# Altium project PCB C3I.PrjPcb
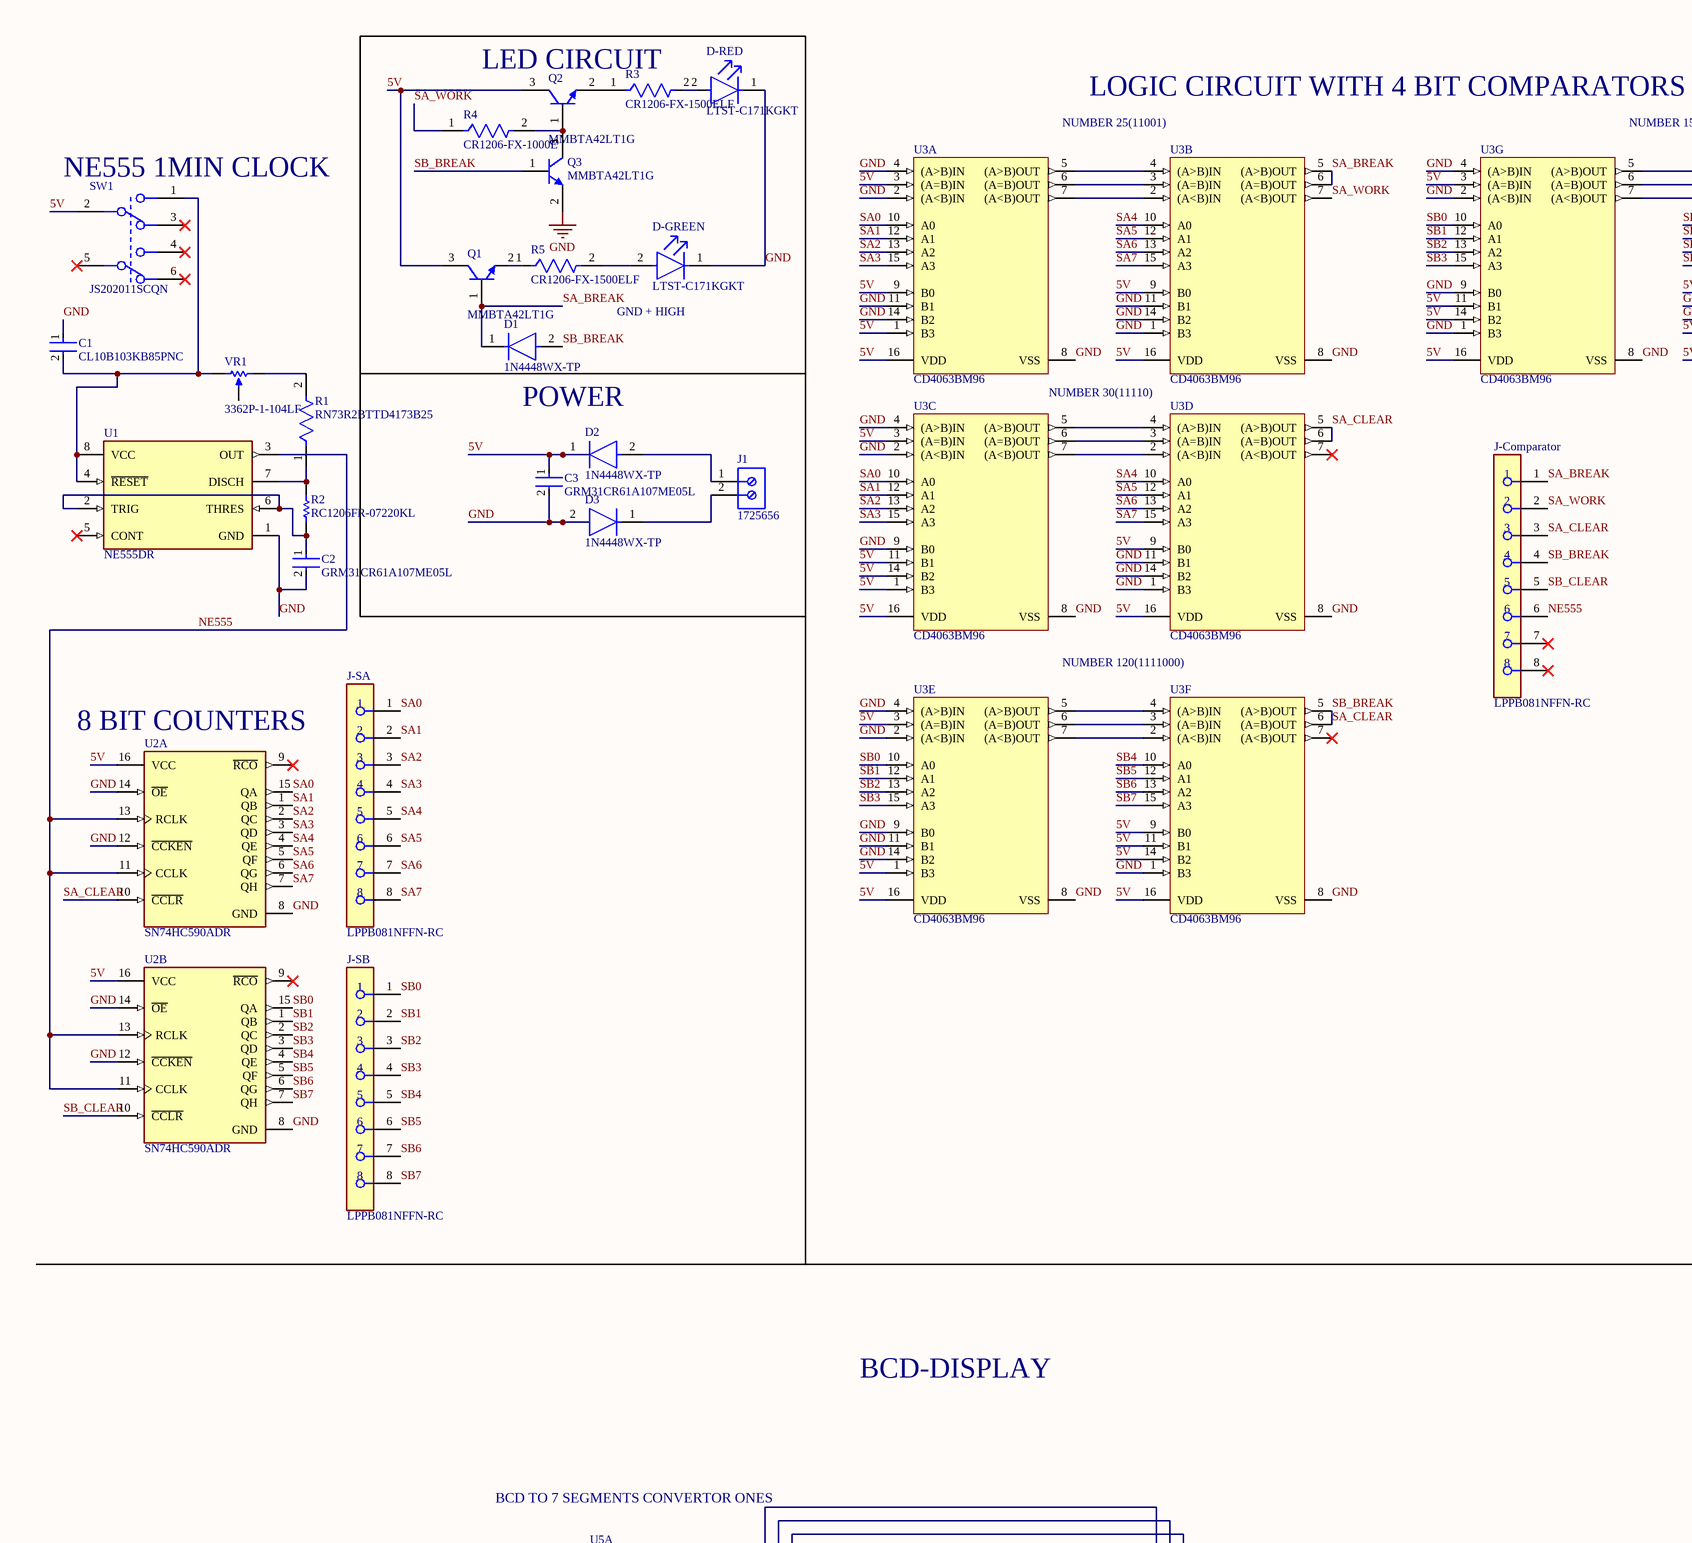
[diagram p0: C3I.SchDoc, top left]
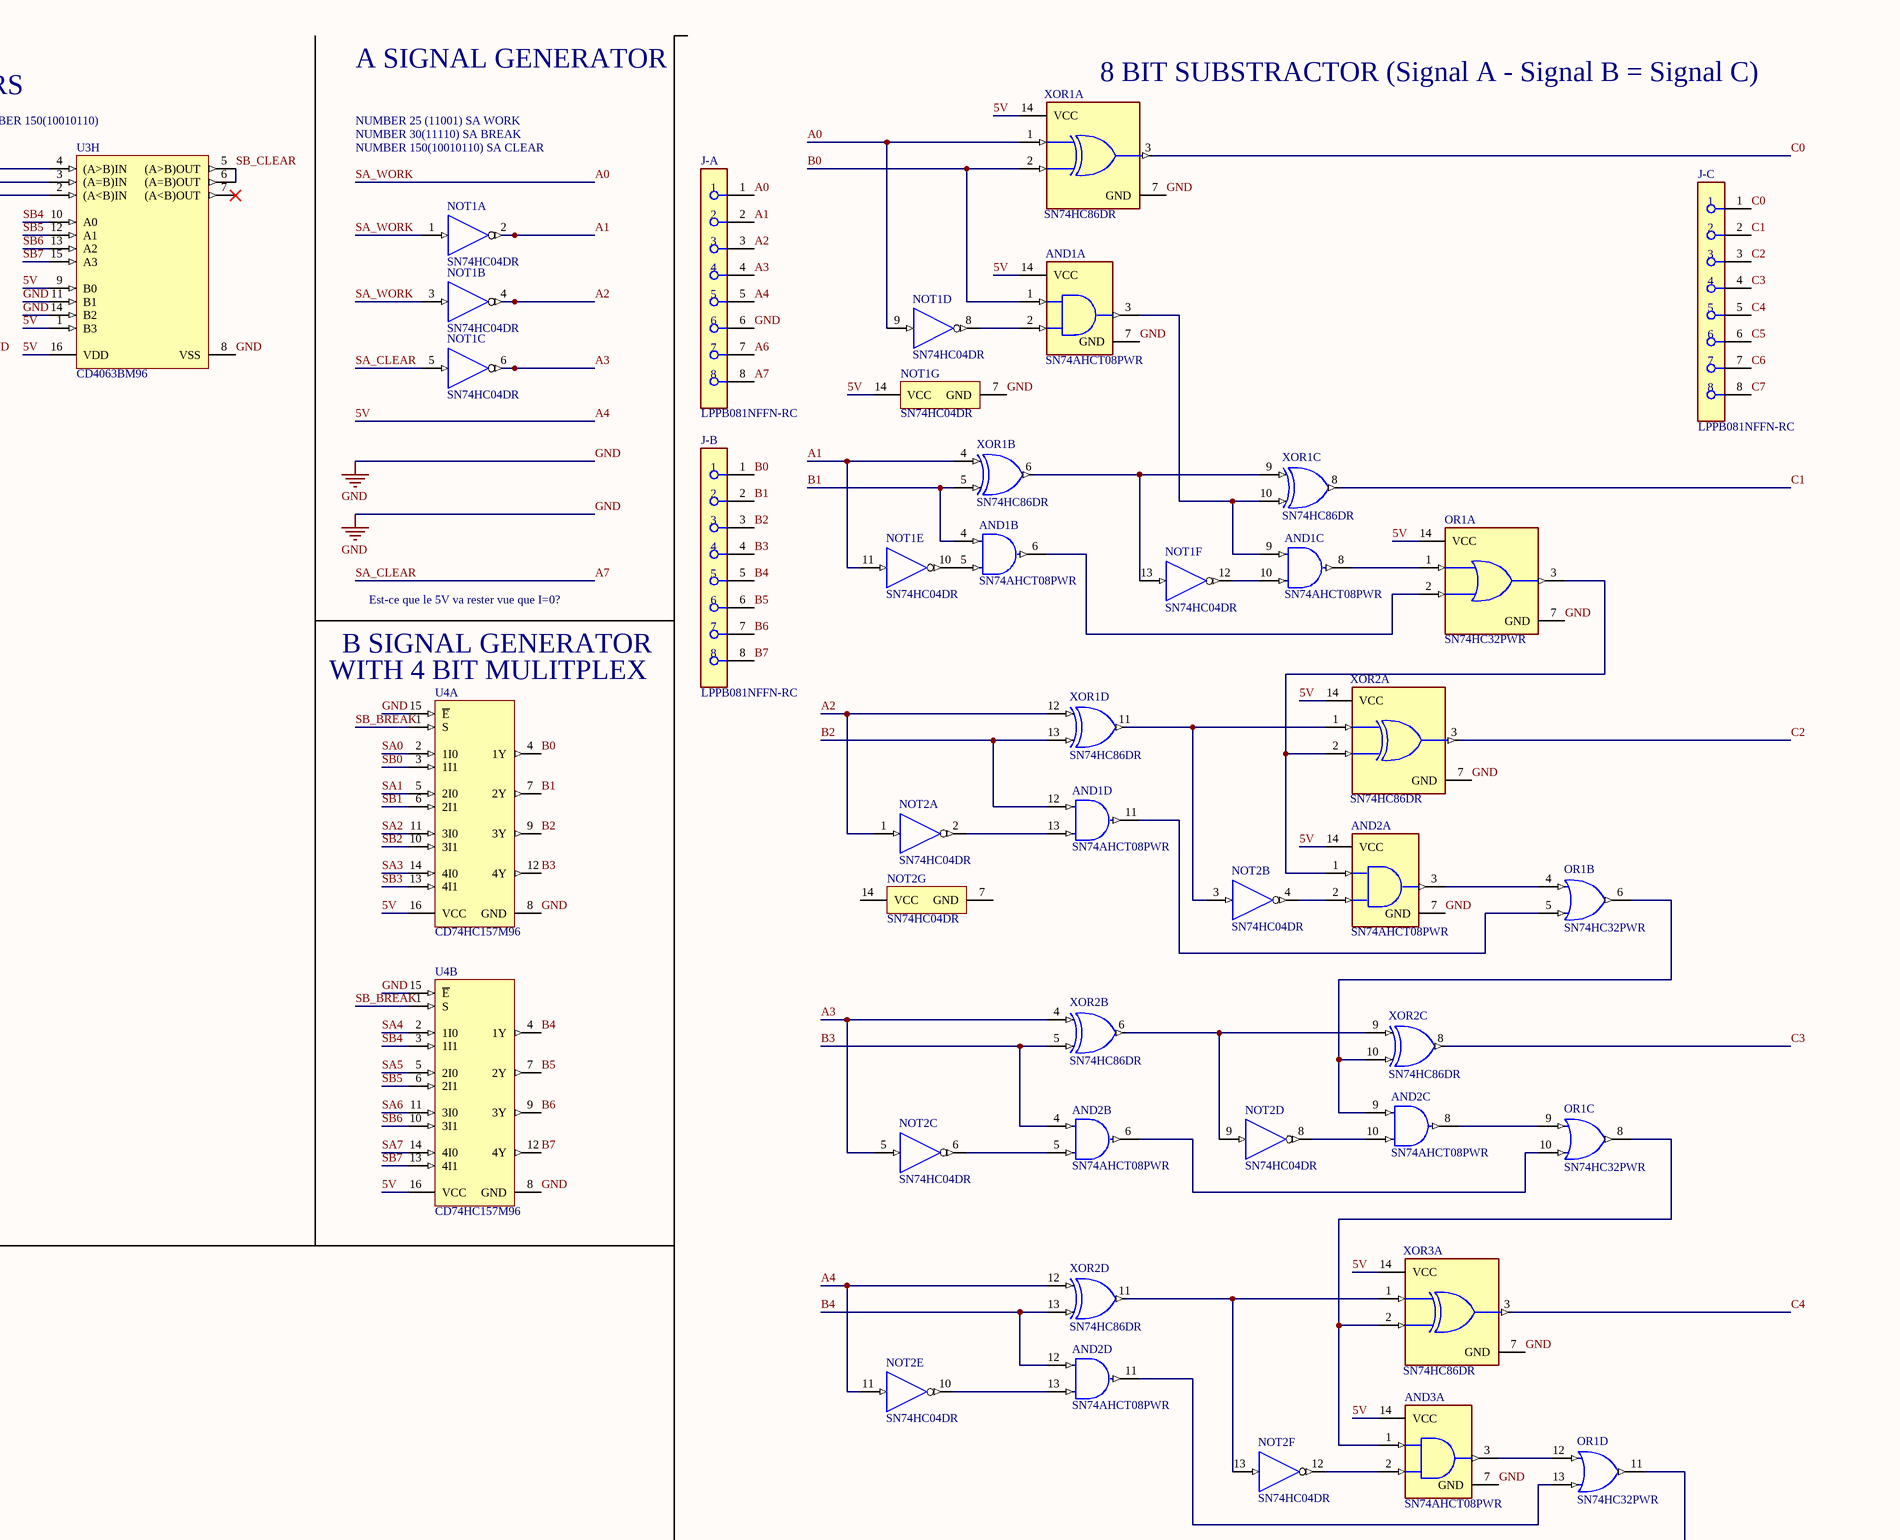
[diagram p1: C3I.SchDoc, top middle]
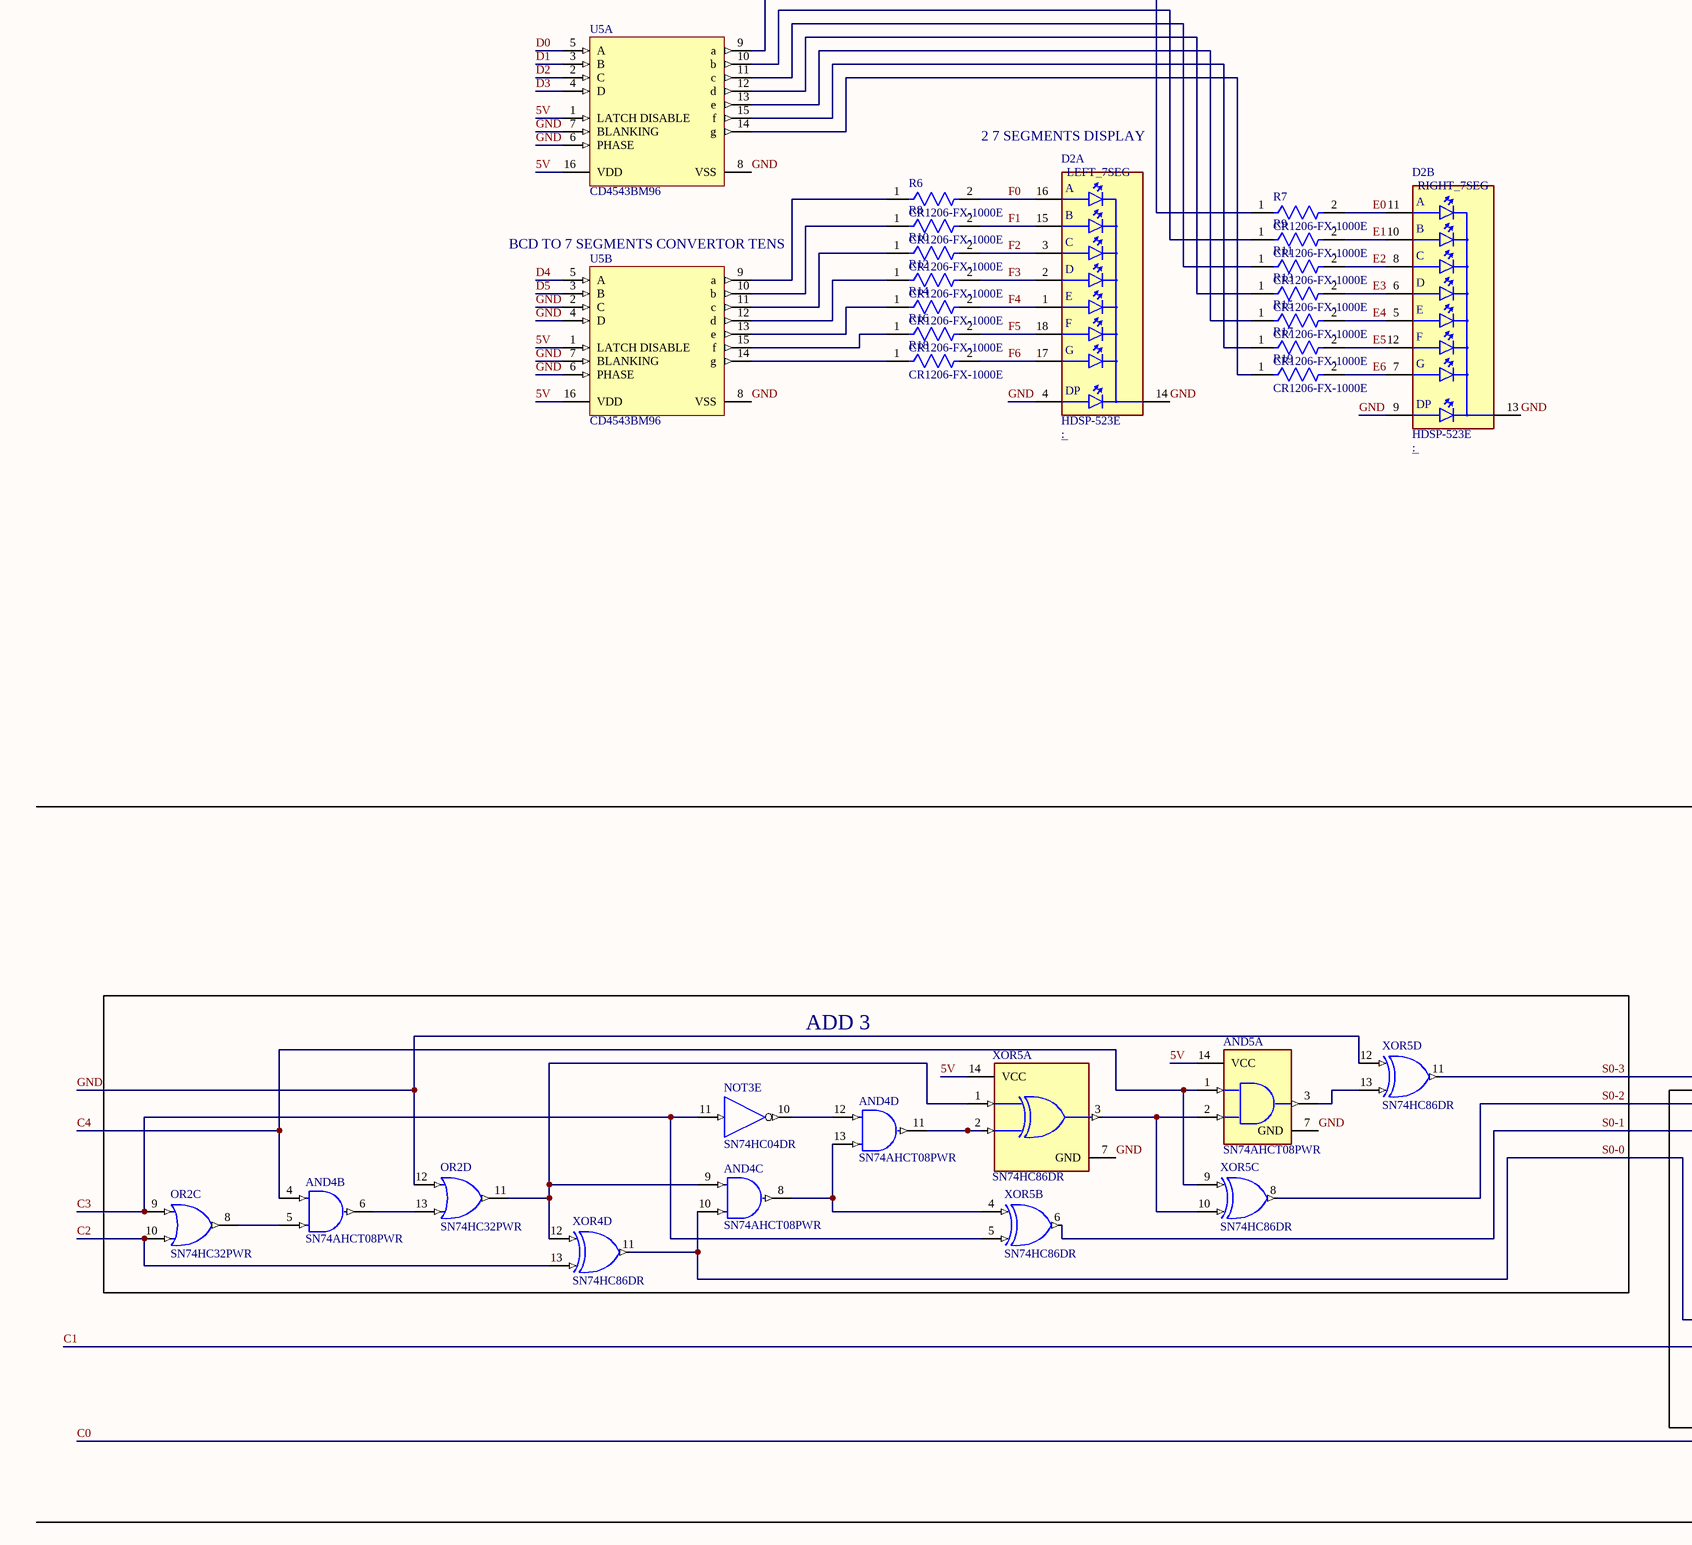
[diagram p2: C3I.SchDoc, bottom left]
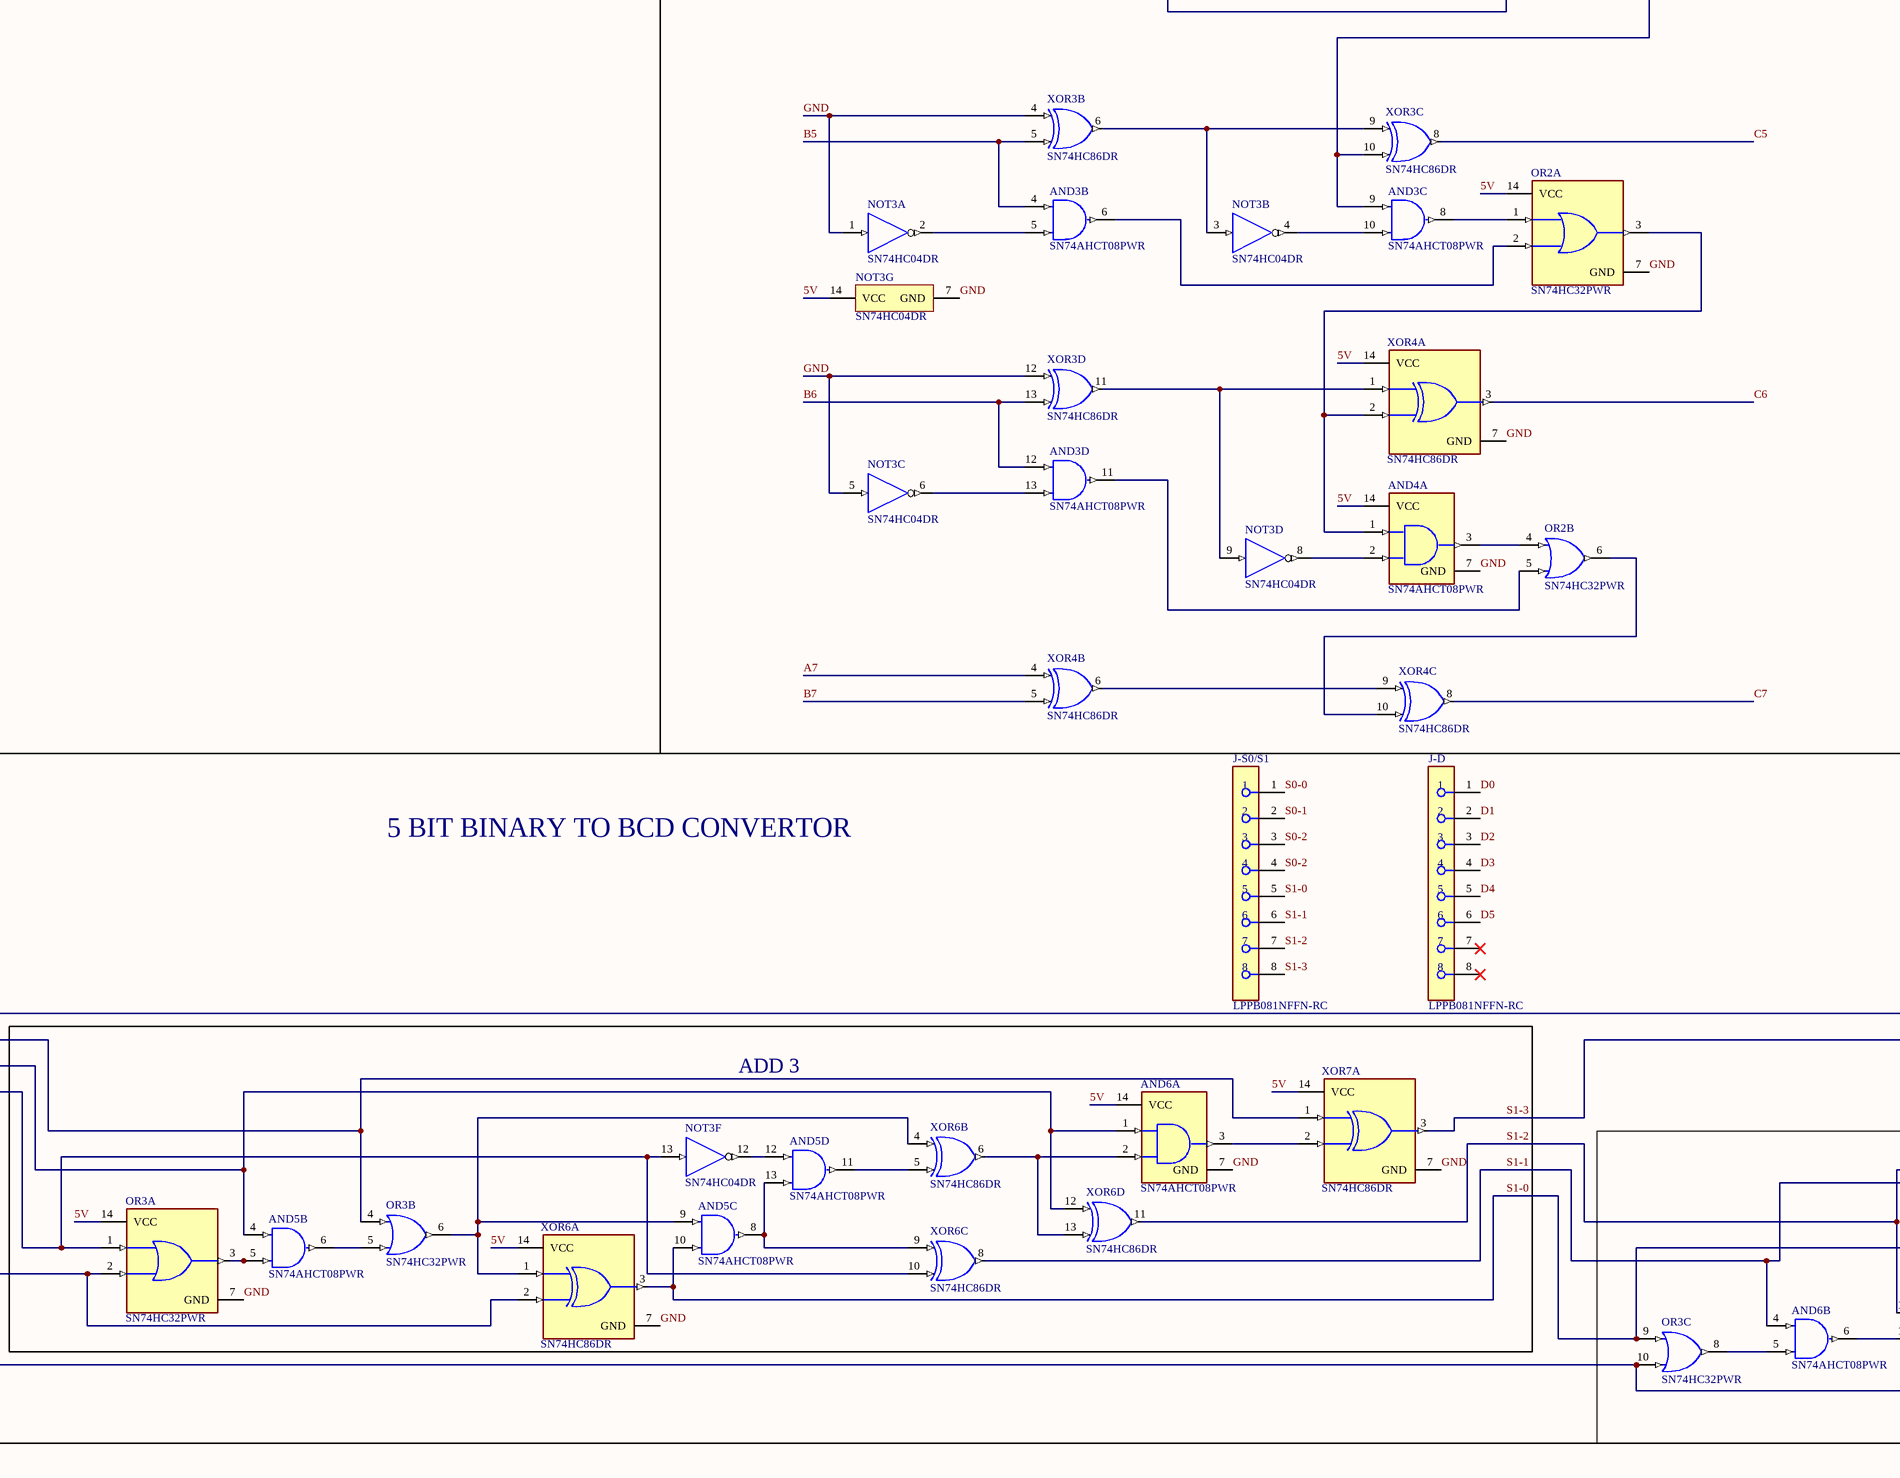
[diagram p3: C3I.SchDoc, bottom middle]
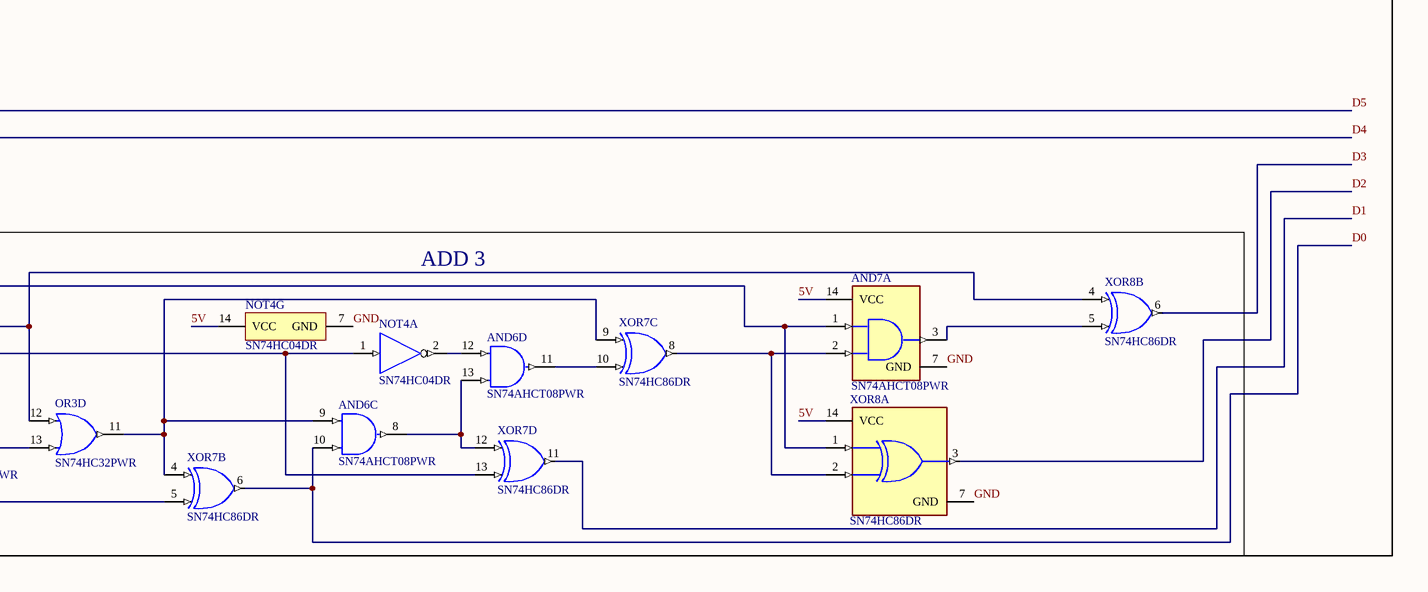
[diagram p4: C3I.SchDoc, bottom right]
1 sheet, 79 parts. Net scope: global (net labels, ports and power ports of the same name join across sheets).
Board file: C3I.PcbDoc

## Sheet C3I.SchDoc
size E; SheetNumber: 1; SheetTotal: 1

### Parts
(Parts that share a designator on the sheet are numbered #1, #2 ... from top to bottom, then left to right.)
AND1  SN74AHCT08PWR  [FP-PW0014A-IPC_C]  (parts A,B,C,D of 4)
AND2  SN74AHCT08PWR  [FP-PW0014A-IPC_C]  (parts A,B,C,D of 4)
AND3  SN74AHCT08PWR  [FP-PW0014A-IPC_C]  (parts A,B,C,D of 4)
AND4  SN74AHCT08PWR  [FP-PW0014A-IPC_C]  (parts A,B,C,D of 4)
AND5  SN74AHCT08PWR  [FP-PW0014A-IPC_C]  (parts A,B,C,D of 4)
AND6  SN74AHCT08PWR  [FP-PW0014A-IPC_C]  (parts A,B,C,D of 4)
AND7  SN74AHCT08PWR  [FP-PW0014A-IPC_C]  (part A of 4)
C1  CL10B103KB85PNC  [FP-CL10-IPC_B]
C2  GRM31CR61A107ME05L  [FP-GRM31C-0_3-e0_3_0_8-IPC_B]
C3  GRM31CR61A107ME05L  [FP-GRM31C-0_3-e0_3_0_8-IPC_B]
D1  1N4448WX-TP  [FP-SOD-323-IPC_C]
D2#1  1N4448WX-TP  [FP-SOD-323-IPC_C]
D2#2  HDSP-523E  [Model Name]  (parts A,B of 2)
D3  1N4448WX-TP  [FP-SOD-323-IPC_C]
D-GREEN  LTST-C171KGKT  [FP-LTST-C171KGKT-MFG]
D-RED  LTST-C171KGKT  [FP-LTST-C171KGKT-MFG]
J1  1725656  [PHOE-1725656-2]
J-A  LPPB081NFFN-RC  [FP-LPPB081NFFN-RC-MFG]
J-B  LPPB081NFFN-RC  [FP-LPPB081NFFN-RC-MFG]
J-C  LPPB081NFFN-RC  [FP-LPPB081NFFN-RC-MFG]
J-Comparator  LPPB081NFFN-RC  [FP-LPPB081NFFN-RC-MFG]
J-D  LPPB081NFFN-RC  [FP-LPPB081NFFN-RC-MFG]
J-S0/S1  LPPB081NFFN-RC  [FP-LPPB081NFFN-RC-MFG]
J-SA  LPPB081NFFN-RC  [FP-LPPB081NFFN-RC-MFG]
J-SB  LPPB081NFFN-RC  [FP-LPPB081NFFN-RC-MFG]
NOT1  SN74HC04DR  [D0014A_M]  (parts A,B,C,D,E,F,G of 7)
NOT2  SN74HC04DR  [D0014A_M]  (parts A,B,C,D,E,F,G of 7)
NOT3  SN74HC04DR  [D0014A_M]  (parts A,B,C,D,E,F,G of 7)
NOT4  SN74HC04DR  [D0014A_M]  (parts A,G of 7)
OR1  SN74HC32PWR  [FP-PW0014A-IPC_A]  (parts A,B,C,D of 4)
OR2  SN74HC32PWR  [FP-PW0014A-IPC_A]  (parts A,B,C,D of 4)
OR3  SN74HC32PWR  [FP-PW0014A-IPC_A]  (parts A,B,C,D of 4)
Q1  MMBTA42LT1G  [ONSC-SOT-23-3-318-08_V]
Q2  MMBTA42LT1G  [ONSC-SOT-23-3-318-08_V]
Q3  MMBTA42LT1G  [ONSC-SOT-23-3-318-08_V]
R1  RN73R2BTTD4173B25  [FP-RN73R2B-IPC_B]
R2  RC1206FR-07220KL  [RESC3116X65X40LL10T20]
R3  CR1206-FX-1500ELF  [FP-CR1206-IPC_A]
R4  CR1206-FX-1000E  [FP-CR1206-IPC_C]
R5  CR1206-FX-1500ELF  [FP-CR1206-IPC_A]
R6  CR1206-FX-1000E  [FP-CR1206-IPC_C]
R7  CR1206-FX-1000E  [FP-CR1206-IPC_C]
R8  CR1206-FX-1000E  [FP-CR1206-IPC_C]
R9  CR1206-FX-1000E  [FP-CR1206-IPC_C]
R10  CR1206-FX-1000E  [FP-CR1206-IPC_C]
R11  CR1206-FX-1000E  [FP-CR1206-IPC_C]
R12  CR1206-FX-1000E  [FP-CR1206-IPC_C]
R13  CR1206-FX-1000E  [FP-CR1206-IPC_C]
R14  CR1206-FX-1000E  [FP-CR1206-IPC_C]
R15  CR1206-FX-1000E  [FP-CR1206-IPC_C]
R16  CR1206-FX-1000E  [FP-CR1206-IPC_C]
R17  CR1206-FX-1000E  [FP-CR1206-IPC_C]
R18  CR1206-FX-1000E  [FP-CR1206-IPC_C]
R19  CR1206-FX-1000E  [FP-CR1206-IPC_C]
SW1  JS202011SCQN  [FP-JS202011SCQN-MFG]
U1  NE555DR  [FP-D0008A-IPC_A]
U2A  SN74HC590ADR  [FP-D0016A-MFG]
U2B  SN74HC590ADR  [FP-D0016A-MFG]
U3A  CD4063BM96  [D0016A_M]
U3B  CD4063BM96  [D0016A_M]
U3C  CD4063BM96  [D0016A_M]
U3D  CD4063BM96  [D0016A_M]
U3E  CD4063BM96  [D0016A_M]
U3F  CD4063BM96  [D0016A_M]
U3G  CD4063BM96  [D0016A_M]
U3H  CD4063BM96  [D0016A_M]
U4A  CD74HC157M96  [D0016A_L]
U4B  CD74HC157M96  [D0016A_L]
U5A  CD4543BM96  [D0016A_L]
U5B  CD4543BM96  [D0016A_L]
VR1  3362P-1-104LF  [BOUR-3362P]
XOR1  SN74HC86DR  [FP-D0014A-IPC_A]  (parts A,B,C,D of 4)
XOR2  SN74HC86DR  [FP-D0014A-IPC_A]  (parts A,B,C,D of 4)
XOR3  SN74HC86DR  [FP-D0014A-IPC_A]  (parts A,B,C,D of 4)
XOR4  SN74HC86DR  [FP-D0014A-IPC_A]  (parts A,B,C,D of 4)
XOR5  SN74HC86DR  [FP-D0014A-IPC_A]  (parts A,B,C,D of 4)
XOR6  SN74HC86DR  [FP-D0014A-IPC_A]  (parts A,B,C,D of 4)
XOR7  SN74HC86DR  [FP-D0014A-IPC_A]  (parts A,B,C,D of 4)
XOR8  SN74HC86DR  [FP-D0014A-IPC_A]  (parts A,B of 4)

### Blocks framed on the sheet
ADD 3: AND4 AND5 NOT3 OR2 XOR4 XOR5
ADD 3: AND5 AND6 NOT3 OR3 XOR6 XOR7
ADD 3: AND6 AND7 NOT4 OR3 XOR7 XOR8

### Nets
GND: AND1.7(GND) AND2.7(GND) AND3.7(GND) AND4.7(GND) AND5.7(GND) AND6.7(GND) AND7.7(GND) C1.1 C2.2 C3.2 D2#2.4(DP_1) D2#2.9(DP_2) D2#2.13(COM_2) D2#2.14(COM_1) D3.2(A) D-GREEN.1(C) D-RED.1(C) J-A.6 NOT1.7(GND) NOT3.1(1A) NOT3.5(3A) NOT3.7(GND) NOT4.7(GND) OR1.7(GND) OR2.7(GND) OR2.12(4A) OR3.7(GND) Q3.2(E) U1.1(GND) U2A.8(GND) U2A.12(~{CCKEN}) U2A.14(~{OE}) U2B.8(GND) U2B.12(~{CCKEN}) U2B.14(~{OE}) U3A.2((A<B)IN) U3A.4((A>B)IN) U3A.8(VSS) U3A.11(B1) U3A.14(B2) U3B.1(B3) U3B.8(VSS) U3B.11(B1) U3B.14(B2) U3C.2((A<B)IN) U3C.4((A>B)IN) U3C.8(VSS) U3C.9(B0) U3D.1(B3) U3D.8(VSS) U3D.11(B1) U3D.14(B2) U3E.2((A<B)IN) U3E.4((A>B)IN) U3E.8(VSS) U3E.9(B0) U3E.11(B1) U3E.14(B2) U3F.1(B3) U3F.8(VSS) U3G.1(B3) U3G.2((A<B)IN) U3G.4((A>B)IN) U3G.8(VSS) U3G.9(B0) U3H.8(VSS) U3H.11(B1) U3H.14(B2) U4A.8(GND) U4A.15(~{E}) U4B.8(GND) U4B.15(~{E}) U5A.6(PHASE) U5A.7(BLANKING) U5A.8(VSS) U5B.2(C) U5B.4(D) U5B.6(PHASE) U5B.7(BLANKING) U5B.8(VSS) XOR1.7(GND) XOR2.7(GND) XOR3.4(2A) XOR3.7(GND) XOR3.12(4A) XOR4.7(GND) XOR5.7(GND) XOR5.12(4A) XOR6.7(GND) XOR7.7(GND) XOR8.7(GND)
5V: AND1.14(VCC) AND2.14(VCC) AND3.14(VCC) AND4.14(VCC) AND5.14(VCC) AND6.14(VCC) AND7.14(VCC) C3.1 D2#1.1(C) J-A.5 NOT1.14(VCC) NOT2.11(5A) NOT3.14(VCC) NOT4.14(VCC) OR1.14(VCC) OR2.14(VCC) OR3.14(VCC) Q1.3(C) Q2.3(C) SW1.2 U2A.16(VCC) U2B.16(VCC) U3A.1(B3) U3A.3((A=B)IN) U3A.9(B0) U3A.16(VDD) U3B.9(B0) U3B.16(VDD) U3C.1(B3) U3C.3((A=B)IN) U3C.11(B1) U3C.14(B2) U3C.16(VDD) U3D.9(B0) U3D.16(VDD) U3E.1(B3) U3E.3((A=B)IN) U3E.16(VDD) U3F.9(B0) U3F.11(B1) U3F.14(B2) U3F.16(VDD) U3G.3((A=B)IN) U3G.11(B1) U3G.14(B2) U3G.16(VDD) U3H.1(B3) U3H.9(B0) U3H.16(VDD) U4A.16(VCC) U4B.16(VCC) U5A.1(LATCH_DISABLE) U5A.16(VDD) U5B.1(LATCH_DISABLE) U5B.16(VDD) XOR1.14(VCC) XOR2.12(4A) XOR2.14(VCC) XOR3.14(VCC) XOR4.14(VCC) XOR5.14(VCC) XOR6.14(VCC) XOR7.14(VCC) XOR8.14(VCC)  [also labelled A4]
A0: J-A.1 J-Comparator.2 NOT1.1(1A) NOT1.3(2A) NOT1.9(4A) R4.1 U3B.7((A<B)OUT) XOR1.1(1A)  [also labelled SA_WORK]
A1: J-A.2 NOT1.2(~{1Y}) NOT1.11(5A) XOR1.4(2A)
A2: J-A.3 NOT1.4(~{2Y}) NOT2.1(1A) XOR1.12(4A)
A3: J-A.4 NOT1.6(~{3Y}) NOT2.5(3A) XOR2.4(2A)
A6: J-A.7
A7: D1.2(A) J-A.8 J-Comparator.3 J-Comparator.4 NOT1.5(3A) Q3.1(B) U2A.10(~{CCLR}) U3D.5((A>B)OUT) U3D.6((A=B)OUT) U3F.5((A>B)OUT) U3F.6((A=B)OUT) U4A.1(S) U4B.1(S) XOR4.4(2A)  [also labelled SA_CLEAR, SB_BREAK]
B0: AND1.1(1A) J-B.1 U4A.4(1Y) XOR1.2(1B)
B1: AND1.4(2A) J-B.2 U4A.7(2Y) XOR1.5(2B)
B2: AND1.12(4A) J-B.3 U4A.9(3Y) XOR1.13(4B)
B3: AND2.4(2A) J-B.4 U4A.12(4Y) XOR2.5(2B)
B4: AND2.12(4A) J-B.5 U4B.4(1Y) XOR2.13(4B)
B5: AND3.4(2A) J-B.6 U4B.7(2Y) XOR3.5(2B)
B6: AND3.12(4A) J-B.7 U4B.9(3Y) XOR3.13(4B)
B7: J-B.8 U4B.12(4Y) XOR4.5(2B)
C0: J-C.1 OR3.10(3B) XOR1.3(1Y) XOR7.5(2B)
C1: J-C.2 OR3.2(1B) XOR1.8(3Y) XOR6.2(1B)
C2: J-C.3 OR2.10(3B) XOR2.3(1Y) XOR4.13(4B)
C3: J-C.4 NOT3.11(5A) OR2.9(3A) XOR2.8(3Y) XOR5.5(2B)
C4: AND4.4(2A) AND5.1(1A) J-C.5 XOR3.3(1Y) XOR5.9(3A)
C5: J-C.6 XOR3.8(3Y)
C6: J-C.7 XOR4.3(1Y)
C7: J-C.8 XOR4.8(3Y)
D0: AND6.10(3B) J-D.1 U5A.5(A) XOR7.6(2Y)
D1: J-D.2 U5A.3(B) XOR7.11(4Y)
D2: J-D.3 U5A.2(C) XOR8.3(1Y)
D3: J-D.4 U5A.4(D) XOR8.6(2Y)
D4: J-D.5 J-S0/S1.8 U5B.5(A) XOR7.3(1Y)  [also labelled S1-3]
D5: J-D.6 U5B.3(B) XOR5.11(4Y)  [also labelled S0-3]
E0: D2#2.11(A_2) R7.2
E1: D2#2.10(B_2) R9.2
E2: D2#2.8(C_2) R11.2
E3: D2#2.6(D_2) R13.2
E4: D2#2.5(E_2) R15.2
E5: D2#2.12(F_2) R17.2
E6: D2#2.7(G_2) R19.2
F0: D2#2.16(A_1) R6.2
F1: D2#2.15(B_1) R8.2
F2: D2#2.3(C_1) R10.2
F3: D2#2.2(D_1) R12.2
F4: D2#2.1(E_1) R14.2
F5: D2#2.18(F_1) R16.2
F6: D2#2.17(G_1) R18.2
NE555: J-Comparator.6 U1.3(OUT) U2A.11(CCLK) U2A.13(RCLK) U2B.11(CCLK) U2B.13(RCLK)
S0-0: AND4.10(3B) J-S0/S1.1 NOT3.13(6A) OR3.1(1A) XOR4.11(4Y) XOR6.10(3B)
S0-1: AND5.4(2A) AND6.1(1A) J-S0/S1.2 XOR5.6(2Y) XOR6.12(4A)
S0-2: J-S0/S1.3 J-S0/S1.4 OR3.4(2A) XOR5.8(3Y) XOR7.1(1A)
S1-0: AND5.10(3B) J-S0/S1.5 NOT4.1(1A) OR3.9(3A) XOR6.3(1Y) XOR7.13(4B)
S1-1: AND6.4(2A) AND7.1(1A) J-S0/S1.6 XOR6.8(3Y) XOR8.1(1A)
S1-2: J-S0/S1.7 OR3.12(4A) XOR6.11(4Y) XOR8.4(2A)
SA0: J-SA.1 U2A.15(QA) U3A.10(A0) U3C.10(A0) U4A.2(1I0)
SA1: J-SA.2 U2A.1(QB) U3A.12(A1) U3C.12(A1) U4A.5(2I0)
SA2: J-SA.3 U2A.2(QC) U3A.13(A2) U3C.13(A2) U4A.11(3I0)
SA3: J-SA.4 U2A.3(QD) U3A.15(A3) U3C.15(A3) U4A.14(4I0)
SA4: J-SA.5 U2A.4(QE) U3B.10(A0) U3D.10(A0) U4B.2(1I0)
SA5: J-SA.6 U2A.5(QF) U3B.12(A1) U3D.12(A1) U4B.5(2I0)
SA6: J-SA.7 U2A.6(QG) U3B.13(A2) U3D.13(A2) U4B.11(3I0)
SA7: J-SA.8 U2A.7(QH) U3B.15(A3) U3D.15(A3) U4B.14(4I0)
SA_BREAK: D1.1(C) J-Comparator.1 Q1.1(B) U3B.5((A>B)OUT) U3B.6((A=B)OUT)
SB0: J-SB.1 U2B.15(QA) U3E.10(A0) U3G.10(A0) U4A.3(1I1)
SB1: J-SB.2 U2B.1(QB) U3E.12(A1) U3G.12(A1) U4A.6(2I1)
SB2: J-SB.3 U2B.2(QC) U3E.13(A2) U3G.13(A2) U4A.10(3I1)
SB3: J-SB.4 U2B.3(QD) U3E.15(A3) U3G.15(A3) U4A.13(4I1)
SB4: J-SB.5 U2B.4(QE) U3F.10(A0) U3H.10(A0) U4B.3(1I1)
SB5: J-SB.6 U2B.5(QF) U3F.12(A1) U3H.12(A1) U4B.6(2I1)
SB6: J-SB.7 U2B.6(QG) U3F.13(A2) U3H.13(A2) U4B.10(3I1)
SB7: J-SB.8 U2B.7(QH) U3F.15(A3) U3H.15(A3) U4B.13(4I1)
SB_CLEAR: J-Comparator.5 U2B.10(~{CCLR}) U3H.5((A>B)OUT) U3H.6((A=B)OUT)
NetAND1_2: AND1.2(1B) NOT1.8(~{4Y})
NetAND1_3: AND1.3(1Y) AND1.9(3A) XOR1.10(3B)
NetAND1_5: AND1.5(2B) NOT1.10(~{5Y})
NetAND1_6: AND1.6(2Y) OR1.2(1B)
NetAND1_8: AND1.8(3Y) OR1.1(1A)
NetAND1_10: AND1.10(3B) NOT1.12(~{6Y})
NetAND1_11: AND1.11(4Y) OR1.5(2B)
NetAND1_13: AND1.13(4B) NOT2.2(~{1Y})
NetAND2_1: AND2.1(1A) OR1.3(1Y) XOR2.2(1B)
NetAND2_2: AND2.2(1B) NOT2.4(~{2Y})
NetAND2_3: AND2.3(1Y) OR1.4(2A)
NetAND2_5: AND2.5(2B) NOT2.6(~{3Y})
NetAND2_6: AND2.6(2Y) OR1.10(3B)
NetAND2_8: AND2.8(3Y) OR1.9(3A)
NetAND2_9: AND2.9(3A) OR1.6(2Y) XOR2.10(3B)
NetAND2_10: AND2.10(3B) NOT2.8(~{4Y})
NetAND2_11: AND2.11(4Y) OR1.13(4B)
NetAND2_13: AND2.13(4B) NOT2.10(~{5Y})
NetAND3_1: AND3.1(1A) OR1.8(3Y) XOR3.2(1B)
NetAND3_2: AND3.2(1B) NOT2.12(~{6Y})
NetAND3_3: AND3.3(1Y) OR1.12(4A)
NetAND3_5: AND3.5(2B) NOT3.2(~{1Y})
NetAND3_6: AND3.6(2Y) OR2.2(1B)
NetAND3_8: AND3.8(3Y) OR2.1(1A)
NetAND3_9: AND3.9(3A) OR1.11(4Y) XOR3.10(3B)
NetAND3_10: AND3.10(3B) NOT3.4(~{2Y})
NetAND3_11: AND3.11(4Y) OR2.5(2B)
NetAND3_13: AND3.13(4B) NOT3.6(~{3Y})
NetAND4_1: AND4.1(1A) OR2.3(1Y) XOR4.2(1B)
NetAND4_2: AND4.2(1B) NOT3.8(~{4Y})
NetAND4_3: AND4.3(1Y) OR2.4(2A)
NetAND4_5: AND4.5(2B) OR2.8(3Y)
NetAND4_6: AND4.6(2Y) OR2.13(4B)
NetAND4_8: AND4.8(3Y) AND4.13(4B) XOR5.4(2A)
NetAND4_9: AND4.9(3A) OR2.11(4Y) XOR4.12(4A) XOR5.1(1A)
NetAND4_11: AND4.11(4Y) XOR5.2(1B)
NetAND4_12: AND4.12(4A) NOT3.10(~{5Y})
NetAND5_2: AND5.2(1B) XOR5.3(1Y) XOR5.10(3B)
NetAND5_3: AND5.3(1Y) XOR5.13(4B)
NetAND5_5: AND5.5(2B) OR3.3(1Y)
NetAND5_6: AND5.6(2Y) OR3.5(2B)
NetAND5_8: AND5.8(3Y) AND5.13(4B) XOR6.9(3A)
NetAND5_9: AND5.9(3A) OR3.6(2Y) XOR6.1(1A) XOR6.4(2A)
NetAND5_11: AND5.11(4Y) XOR6.5(2B)
NetAND5_12: AND5.12(4A) NOT3.12(~{6Y})
NetAND6_2: AND6.2(1B) XOR6.6(2Y) XOR6.13(4B)
NetAND6_3: AND6.3(1Y) XOR7.2(1B)
NetAND6_5: AND6.5(2B) OR3.8(3Y)
NetAND6_6: AND6.6(2Y) OR3.13(4B)
NetAND6_8: AND6.8(3Y) AND6.13(4B) XOR7.12(4A)
NetAND6_9: AND6.9(3A) OR3.11(4Y) XOR7.4(2A) XOR7.9(3A)
NetAND6_11: AND6.11(4Y) XOR7.10(3B)
NetAND6_12: AND6.12(4A) NOT4.2(~{1Y})
NetAND7_2: AND7.2(1B) XOR7.8(3Y) XOR8.2(1B)
NetAND7_3: AND7.3(1Y) XOR8.5(2B)
NetC1_2: C1.2 SW1.1 U1.4(~{RESET}) U1.8(VCC) VR1.1(CCW)
NetC2_1: C2.1 R2.1 U1.2(TRIG) U1.6(THRES)
NetD2#1_2: D2#1.2(A) J1.1
NetD3_1: D3.1(C) J1.2
NetD-GREEN_2: D-GREEN.2(A) R5.2
NetD-RED_2: D-RED.2(A) R3.2
NetNOT1_13: NOT1.13(6A) XOR1.6(2Y) XOR1.9(3A)
NetNOT2_3: NOT2.3(2A) XOR1.11(4Y) XOR2.1(1A)
NetNOT2_9: NOT2.9(4A) XOR2.6(2Y) XOR2.9(3A)
NetNOT2_13: NOT2.13(6A) XOR2.11(4Y) XOR3.1(1A)
NetNOT3_3: NOT3.3(2A) XOR3.6(2Y) XOR3.9(3A)
NetNOT3_9: NOT3.9(4A) XOR3.11(4Y) XOR4.1(1A)
NetOR2_6: OR2.6(2Y) XOR4.10(3B)
NetQ1_2: Q1.2(E) R5.1
NetQ2_1: Q2.1(B) Q3.3(C) R4.2
NetQ2_2: Q2.2(E) R3.1
NetR1_1: R1.1 R2.2 U1.7(DISCH)
NetR1_2: R1.2 VR1.3(CW)
NetR6_1: R6.1 U5B.9(a)
NetR7_1: R7.1 U5A.9(a)
NetR8_1: R8.1 U5B.10(b)
NetR9_1: R9.1 U5A.10(b)
NetR10_1: R10.1 U5B.11(c)
NetR11_1: R11.1 U5A.11(c)
NetR12_1: R12.1 U5B.12(d)
NetR13_1: R13.1 U5A.12(d)
NetR14_1: R14.1 U5B.13(e)
NetR15_1: R15.1 U5A.13(e)
NetR16_1: R16.1 U5B.15(f)
NetR17_1: R17.1 U5A.15(f)
NetR18_1: R18.1 U5B.14(g)
NetR19_1: R19.1 U5A.14(g)
NetU3A_5: U3A.5((A>B)OUT) U3B.4((A>B)IN)
NetU3A_6: U3A.6((A=B)OUT) U3B.3((A=B)IN)
NetU3A_7: U3A.7((A<B)OUT) U3B.2((A<B)IN)
NetU3C_5: U3C.5((A>B)OUT) U3D.4((A>B)IN)
NetU3C_6: U3C.6((A=B)OUT) U3D.3((A=B)IN)
NetU3C_7: U3C.7((A<B)OUT) U3D.2((A<B)IN)
NetU3E_5: U3E.5((A>B)OUT) U3F.4((A>B)IN)
NetU3E_6: U3E.6((A=B)OUT) U3F.3((A=B)IN)
NetU3E_7: U3E.7((A<B)OUT) U3F.2((A<B)IN)
NetU3G_5: U3G.5((A>B)OUT) U3H.4((A>B)IN)
NetU3G_6: U3G.6((A=B)OUT) U3H.3((A=B)IN)
NetU3G_7: U3G.7((A<B)OUT) U3H.2((A<B)IN)
NetXOR4_6: XOR4.6(2Y) XOR4.9(3A)

Not connected (* = marked no-connect by the designer): J-Comparator 7* 8*; J-D 7* 8*; NOT2 7(GND) 14(VCC); SW1 3* 4* 5* 6*; U1 5(CONT)*; U2A 9(~{RCO})*; U2B 9(~{RCO})*; U3D 7((A<B)OUT)*; U3F 7((A<B)OUT)*; U3H 7((A<B)OUT)*; VR1 2(S)

### Notes on the sheet
- LED CIRCUIT
- A SIGNAL GENERATOR
- NUMBER 25(11001)
- LOGIC CIRCUIT WITH 4 BIT COMPARATORS
- NUMBER 150(10010110)
- NUMBER 30(11110) SA BREAK
- NUMBER 25 (11001) SA WORK
- (near XOR1) 8 BIT SUBSTRACTOR (Signal A - Signal B = Signal C)
- (near SW1) NE555 1MIN CLOCK
- NUMBER 150(10010110) SA CLEAR
- GND + HIGH
- POWER
- NUMBER 30(11110)
- Est-ce que le 5V va rester vue que I=0?
- NUMBER 120(1111000)
- B SIGNAL GENERATOR
- (near U2A) 8 BIT COUNTERS
- (near U4A) WITH 4 BIT MULITPLEX
- BCD-DISPLAY
- BCD TO 7 SEGMENTS CONVERTOR ONES
- 2 7 SEGMENTS DISPLAY
- (near U5B) BCD TO 7 SEGMENTS CONVERTOR TENS
- 5 BIT BINARY TO BCD CONVERTOR
- (in symbol HDSP-523E, part A) LEFT_7SEG; A; B; C; D; E; F; G; DP
- (in symbol HDSP-523E, part B) RIGHT_7SEG; A; B; C; D; E; F; G; DP

### Library data of the parts
AND1-AND7 = CMP-0777-00390-4: IC GATE AND 4CH 2-INP 14TSSOP; Turn-On Delay Time: 8ns; Number of Bits: 4; Max Supply Voltage: 5.5V; Min Supply Voltage: 4.5V; Number of Inputs: 2; Logic Function: AND GATE; Propagation Delay: 7.9ns; Number of Outputs: 1; Operating Supply Voltage: 5V; Schmitt Trigger Input: No; Low Level Output Current: 8mA; Quiescent Current: 2uA; High Level Output Current: -8mA; Number of Pins: 14; Height: 1.15mm; Radiation Hardening: No; Number of Gates: 4; Mount: Surface Mount; Max Operating Temperature: 125°C; Number of Output Lines: 1; Min Operating Temperature: -40°C; Weight: 0.002018oz; Contact Plating: Gold; Number of Circuits: 4; Width: 4.4mm; Length: 5mm; Number of Elements: 4; Package Quantity: 2000; REACH SVHC: No SVHC; Case/Package: TSSOP; Lead Free: Lead Free; Number of Input Lines: 2; Packaging: Tape and Reel
C1 = CMP-13271-001215-1: Cap Ceramic 10nF 50V X7R ±10% Pad SMD 0603 +125°C T/R; Dielectric: X7R; Features: Soft Termination; Packaging: Tape and Reel; Voltage Rating: 50V; Ratings: AEC-Q200; Radiation Hardening: No; Height: 0.8mm; Package Quantity: 4000; Case Code (Metric): 1608; Capacitance: 10nF; Length: 1.6mm; Width: 0.031inch; Case/Package: 0603; Thickness: 0.035inch; Tolerance: 10%; Max Operating Temperature: 125°C; Lead Free: Lead Free; Mount: Surface Mount; Min Operating Temperature: -55°C; Case Code (Imperial): 0603; Voltage: 50V; Depth: 0.8mm
C2 C3 = CMP-06035-062934-1: CAP CER MLCC; RoHS Compliant: Yes
D1 D2#1 D3 = CMP-56207-000006-1: DIODE GEN PURP 75V 250MA SOD323; Recovery Time: 4ns; Forward Current: 500mA; Current Rating: 150mA; Capacitance: 4pF; Max Repetitive Reverse Voltage (Vrrm): 100V; Peak Non-Repetitive Surge Current: 4A; Polarity: Standard; Element Configuration: Single; Forward Voltage: 1.25V; Power Dissipation: 200mW; Max Reverse Leakage Current: 2.5uA; Max Reverse Voltage (DC): 75V; Package Quantity: 1; Height: 1mm; Packaging: Tape and Reel; Max Operating Temperature: 150°C; Voltage Rating (DC): 75V; Mount: Surface Mount; RoHS Compliant: Yes; Series: -; Output Current: 500mA; Reverse Recovery Time-Max: 4ns; Max Surge Current: 4A; Reverse Recovery Time: 4ns; Length: 1.8mm; Width: 1.35mm; Average Rectified Current: 250mA; Lead Free: Lead Free; Number of Pins: 2; Min Operating Temperature: -65°C
D2#2 = HDSP-523E: Display Modules - LED Character and Numeric Red 7-Segment 2 Character Common Cathode 2.05V 20mA 0.732 H x 0.984 W x 0.315 D (18.60mm x 25.00mm x 8.00mm) 18-DIP (0.600, 15.24mm); MF: Broadcom; Price: None; SnapEDA_Link: https://www.snapeda.com/parts/HDSP-523E/Broadcom/view-part/115199/?ref=snap; Mouser-Purchase-URL: https://snapeda.com/shop?store=Mouser&id=115199; Value: *; MP: HDSP-523E; Package: DIP-18 Broadcom; Availability: Warning; DigiKey-Purchase-URL: https://snapeda.com/shop?store=DigiKey&id=115199
D-GREEN D-RED = CMP-22017-000037-1: LED GREEN CLEAR SMD; Number of LEDs: 1; Viewing Angle: 130°; Lens Style: Rectangular; Dominant Wavelength: 571nm; Test Current: 20mA; Luminous Intensity: 35mcd; Power Rating: 75mW; Forward Voltage: 2.4V; Forward Current: 30mA; Reverse Voltage: 5V; Lens Color: Colorless; Wavelength: 574nm; Height: 0.8mm; Illumination Color: Green; Length: 2mm; Case/Package: 0805; Number of Pins: 2; Number of Elements: 1; Package Quantity: 1; Depth: 1.25mm; Lens Transparency: Clear; Width: 1.25mm; Color: Green; Radiation Hardening: No; Mount: Surface Mount; Packaging: Tape and Reel; Case Code (Metric): 2012; Lead Free: Lead Free; Max Operating Temperature: 85°C; Min Operating Temperature: -55°C; Case Code (Imperial): 0805; Power Dissipation: 75mW
J1 = CMP-2000-05299-1: Male Header, Pitch 2.54 mm, 1 x 2 Position, Height 9 mm, Tail Length 3.5 mm; Manufacturer: Phoenix Contact; Number of contacts: 2; Content: 250pc(s); Pitch: 2.54mm; Industrial packaging: Yes; Colour: Green; Manufacturer part No.: 1725656; Type: MPT0,5/2-2,54; Datasheet URL: http://datasheet.octopart.com/1725656-Phoenix-Contact-datasheet-5302866.pdf; Manufacturer URL: http://www.phoenixcontact.com/; Datasheet Version: Apr-08
J-A J-B J-C J-Comparator J-D J-S0/S1 J-SA J-SB = CMP-25680-000039-1: CONN HDR 8POS 0.05 GOLD PCB; Connector Type: Header; Pitch: 0.05inch; Number of Positions: 8; Packaging: Bulk; Contact Type: Female Socket; Termination: Solder; RoHS Compliant: Yes; Lead Free: Lead Free; Package Quantity: 1; Mount: Through Hole; Contact Plating: Gold; Number of Rows: 1
NOT1-NOT4 = CMP-1615-00282-2: Hex Inverters, D0014A, LARGE T&R; Manufacturer: Texas Instruments; Bits(#): 6; VCC(Min)(V): 2; Technology Family: HC; Output Drive (IOL/IOH)(Max)(mA): -4/4; tpd @ Nom Voltage(Max)(ns): 20; Voltage(Nom)(V): 5; Schmitt Trigger: No; ICC @ Nom Voltage(Max)(mA): 0.02; Rating: Catalog; Input Type: CMOS; Code_JEDEC: MS-012; VCC(Max)(V): 6; PackageReference: D0014A; F @ Nom Voltage(Max)(Mhz): 20; Generic Part Number: SN74HC04; Operating Temperature Range(C): -40 to 85; Output Type: CMOS; DatasheetVersion: SCLS078F
OR1-OR3 = CMP-1573-00186-4: IC GATE OR 4CH 2-INP 14TSSOP; Number of Outputs: 1; Number of Gates: 4; Operating Supply Voltage: 5V; Number of Input Lines: 2; Propagation Delay: 21ns; Min Supply Voltage: 2V; Logic Function: OR GATE; Low Level Output Current: 5.2mA; Max Supply Voltage: 6V; High Level Output Current: -5.2mA; Quiescent Current: 2uA; Turn-On Delay Time: 25ns; Max Operating Temperature: 85°C; Min Operating Temperature: -40°C; REACH SVHC: No SVHC; Number of Circuits: 4; Number of Bits: 4; Package Quantity: 2000; Lead Free: Lead Free; Number of Output Lines: 1; Case/Package: TSSOP; RoHS Compliant: Yes; Number of Elements: 4; Number of Inputs: 2; Number of Pins: 14; Radiation Hardening: No; Mount: Surface Mount; Weight: 0.002018oz; Packaging: Tape and Reel; Output Current: 5.2mA; Contact Plating: Gold
Q1-Q3 = CMP-1048-00662-1: High Voltage Transistor, NPN Silicon, 3-Pin SOT-23, Pb-Free, Tape and Reel; Manufacturer: On Semiconductor; fT Min (MHz): 50; IC Continuous (A): 0.5; ComponentLink1URL: http://www.onsemi.com/; ComponentLink3URL: http://www.onsemi.cn/pub_link/Collateral/318-08.PDF; RoHS: TRUE; ComponentLink2Description: Datasheet; PartNumber: MMBTA42LT1G; Polarity: NPN; DatasheetVersion: Rev. 12; PackageReference: SOT-23-3-318-08; PackageDescription: 3-Pin Small Outline Transistor, Body 2.92 x 1.3 mm, Pitch 0.95 mm; ComponentLink3Description: Package Specification; ComponentLink1Description: Manufacturer URL; Packing: Tape and Reel; PackageVersion: Rev. AP, 11/2009; Mounting Technology: Surface Mount; ComponentLink2URL: http://www.onsemi.cn/pub_link/Collateral/MMBTA42LT1-D.PDF
R1 = CMP-04015-031724-1: 417kΩ ±0.1% 0.25W, 1/4W Chip Resistor 1206 (3216 Metric) Moisture Resistant Thin Film
R2 = CMP-2000-06968-1: Chip Resistor, 220 KOhm, +/- 1%, 0.25 W, -55 to 155 degC, 1206 (3216 Metric), RoHS, Tape and Reel; Manufacturer: Yageo; Resistance: 220kOhms; Temperature Coefficient: 100PPM/C; Power Rating: 250mW(1/4W); Voltage Rating: 200V; Series: RC; Package Reference: 1206; Manufacturer URL: http://www.yageo.com/; Termination Style: SMD/SMT; Tolerance: 1%; Case Code - mm: 3216; Operating Temperature Range: -55Cto+155C; Product: ThickFilmResistorsGeneralPurpose; Package Description: 2-Pin Surface Mount Device, Body 3.1 x 1.6 mm; Mounting Technology: SurfaceMount; Packaging: Reel; Datasheet URL: http://www.yageo.com/documents/recent/PYu-RC_Group_51_RoHS_L_7.pdf; Datasheet Version: Rev. 7, 05/2017; Case Code - in: 1206
R3 R5 = CMP-07231-004600-1: Thick Film Chip Resistors 1206 150Ω 0.25W 1% 100ppm/°C; Power Rating: 250mW; Voltage Rating (DC): 200V; Resistance: 150R; Thickness: 610um; Temperature Coefficient: 100ppm/°C; Width: 1.6mm; Min Operating Temperature: -55°C; Length: 3.2mm; Case Code (Metric): 3216; Package Quantity: 5000; Packaging: Tape and Reel; Number of Pins: 2; Case/Package: 1206; Radiation Hardening: No; Composition: Thick Film; REACH SVHC: No SVHC; Case Code (Imperial): 1206; Depth: 1.6mm; Height: 0.03inch; Termination: SMD/SMT; Number of Terminations: 2; Max Power Dissipation: 250mW; Military Standard: Not; Max Operating Temperature: 155°C; Voltage Rating: 200V; Contact Plating: Tin; Mount: Surface Mount; Tolerance: 1%
R4 R6-R19 = CMP-07231-001946-1: Thick Film Chip Resistors 1206 100Ω 0.25W 1% 100ppm/°C; Resistance: 100R; Power Rating: 250mW; Voltage Rating: 200V; Composition: Thick Film; Width: 1.6mm; Case Code (Metric): 3216; Mount: Surface Mount; Length: 3.2mm; Termination: SMD/SMT; Thickness: 610um; Depth: 1.6mm; Packaging: Tape and Reel; Package Quantity: 5000; Military Standard: Not; Case/Package: 1206; Min Operating Temperature: -55°C; Case Code (Imperial): 1206; Max Operating Temperature: 125°C; Tolerance: 1%; Temperature Coefficient: 100ppm/°C; Height: 0.6mm
SW1 = CMP-2000-05087-3: SWITCH SLIDE DPDT 300MA 6V; Switch Function: On-On; Actuator Type: Standard; Switch Travel: 2mm; Actuator Color: Black; Contact Resistance: 70mR; Electrical Life: 5000Cycles; Actuator Material: Nylon; REACH SVHC: No SVHC; Series: JS; Min Operating Temperature: -20°C; Depth: 7.5mm; Housing Material: Nylon; Voltage Rating (DC): 6V; Max Operating Temperature: 85°C; Contact Current Rating: 300mA; Package Quantity: 1; Contact Plating: Silver; Contact Material: Copper Alloy; Throw Configuration: DPDT; Current Rating: 300mA; Orientation: Vertical; Max Current Rating: 300mA; Max Voltage Rating (DC): 6V; Flammability Rating: UL94 V-2; Length: 9mm; Packaging: Tape and Reel; Mount: Surface Mount; Actuator Length: 2mm; Lead Free: Lead Free; Termination: Gull Wing; Radiation Hardening: No
U1 = CMP-1685-00007-2: IC OSC SGL TIMER 100KHZ 8-SOIC; Low Level Output Current: 200mA; Quiescent Current: 15mA; Min Supply Voltage: 4.5V; Number of Timers/Counters: 1; Max Supply Voltage: 16V; Operating Supply Current: 10mA; High Level Output Current: -200mA; Packaging: Tape and Reel; Frequency: 100kHz; Weight: 0.002561oz; REACH SVHC: No SVHC; Package Quantity: 2500; Width: 3.91mm; Max Operating Temperature: 70°C; Contact Plating: Gold; Lead Free: Lead Free; Number of Pins: 8; Min Operating Temperature: 0°C; Radiation Hardening: No; Length: 4.9mm; Case/Package: SOIC; Height: 1.58mm; Mount: Surface Mount
U2A U2B = CMP-1623-00202-3: IC 8-BIT BINARY COUNTER 16-SOIC; Manufacturer: Texas Instruments; Frequency: 8-40MHz; Standoff Height: 0.1mm; Number Of Circuits: 1; Logic Function Desc: Non-Inverting; Min Supply Voltage: 2V; Nominal Supply Current: 80uA; Sync Async: Asynchronous; Propagation Delay: 20ns; Number Of Outputs: 8; Max Supply Voltage: 6V; Automotive: No; RoHS: TRUE; Device Class L2: Logic ICs; Lead Free: Yes; Temperature Range Low: -40°C; ComponentLink2URL: http://www.ti.com/lit/ds/symlink/sn74hc590a.pdf; Ambient Temperature Range High: +85°C; Height: 1.75mm; Mouser Description: 8-Bit Binary Counters With 3-State Output Registers 16-SOIC -40 to 85; Device Class L3: Counters; Digikey Description: IC 8-BIT BINARY COUNTER 16-SOIC; ComponentLink2Description: Datasheet; Category: IC; Octopart: https://octopart.com/sn74hc590adr-texas+instruments-432066; Manufacturer Part Number: SN74HC590ADR; Device Class L1: Integrated Circuits (ICs); Number Of Inputs: 1; Package: D0016A; Ambient Temperature Range Low: -40°C; Temperature Range High: +85°C; Temperature: -40°C to +85°C
U3A U3B U3C U3D U3E U3F U3G U3H = CMP-1581-00006-3: 4-Bit Magnitude Comparators, D0016A, LARGE T&R; Manufacturer: Texas Instruments; ICC @ Nom Voltage(Max)(mA): 0.3; Voltage(Nom)(V): 10; Output Type: CMOS; Bits(#): 4; Output Drive (IOL/IOH)(Max)(mA): 4/-4; Rating: Catalog; F @ Nom Voltage(Max)(Mhz): 8; tpd @ Nom Voltage(Max)(ns): 500; VCC(Min)(V): 3; VCC(Max)(V): 18; Schmitt Trigger: No; Technology Family: CD4000; Generic Part Number: CD4063B; DatasheetVersion: SCHS050C; Input Type: CMOS; PackageReference: D0016A; Operating Temperature Range(C): -55 to 125
U4A U4B = CMP-1633-00185-2: High Speed CMOS Logic Quad 2-Input Multiplexers, D0016A, LARGE T&R; Manufacturer: Texas Instruments; Rating: Catalog; Input Type: LVTTL/CMOS; Bits(#): 2; F @ Nom Voltage(Max)(Mhz): 28; Output Drive (IOL/IOH)(Max)(mA): 5.2/-5.2; ICC @ Nom Voltage(Max)(mA): 0.08; Configuration: 2：1; VCC(Max)(V): 6; Technology Family: HC; Voltage(Nom)(V): 3.3,5; tpd @ Nom Voltage(Max)(ns): 10; Schmitt Trigger: No; Function: Encoder/Multiplexer; Channels(#): 4; Type: Standard; Code_JEDEC: MS-012 variation AC; VCC(Min)(V): 2; Operating Temperature Range(C): -55 to 125; Output Type: CMOS; Generic Part Number: CD74HC157; PackageReference: D0016A; DatasheetVersion: SCHS153C
U5A U5B = CMP-0388-00008-2: CMOS BCD-to-7-Segment Latch / Decoder / Driver for Liquid-Crystal Displays, 3 V, -55 to 125 degC, 16-pin SOIC (D16), Green (RoHS & no Sb/Br); Manufacturer: Texas Instruments; Vin(Min)(V): 3; SubFamily: Discrete Segment LED Driver; Rating: Catalog; ComponentLink2URL: http://www.ti.com/general/docs/lit/getliterature.tsp?genericPartNumber=CD4543B&fileType=pdf; ComponentLink1URL: http://www.ti.com/; PartNumber: CD4543BM96; ComponentLink3URL: http://www.ti.com/litv/pdf/mpds178g; Mounting Technology: Surface Mount; DatasheetVersion: SCHS086D; Code_JEDEC: MS-012; PackageDescription: 16-Pin Plastic Small Outline, Body 9.90 x 3.90 mm, Pitch 1.27 mm; ComponentLink1Description: Manufacturer URL; ComponentLink3Description: Package Specification; PackageVersion: 4040047-6/M; Eco-Plan: Green (RoHS & no Sb/Br); ComponentLink2Description: Datasheet; PackageReference: D0016A
VR1 = CMP-1747-00003-1: Square Trimpot(R) Trimming Potentiometer, 100 KOhm, 300 V, -55 to 125 degC, 3-Pin THD, RoHS, Tube; Voltage Rating: 250 V; Case\Package: Axial; Tolerance: 1%; Power Rating: 250 mW; Resistance: 1 mohm; RoHSCompliant: true; ComponentLink2URL: http://www.bourns.com/docs/Product-Datasheets/3362.pdf; ComponentLink1Description: Manufacturer URL; DatasheetVersion: May-16; Package Quantity: 200; ComponentLink2Description: Datasheet; Min Operating Temperature: -55 degC; Mount: Through Hole; PackageDescription: 3-Pin Through Hole Device, Body 6.6 x 6.99 mm, Pitch 2.54 mm; Length: 0.248 inch; ComponentLink1URL: http://www.bourns.com/; PackageReference: 3326P; Max Operating Temperature: 155 degC; Packaging: Bulk
XOR1-XOR8 = CMP-0778-00001-4: IC GATE XOR 4CH 2-INP 14SOIC; Quiescent Current: 2uA; Number of Outputs: 1; Logic Function: XOR GATE; Number of Gates: 4; Min Supply Voltage: 2V; Max Supply Voltage: 6V; Propagation Delay: 17ns; Turn-On Delay Time: 21ns; High Level Output Current: -5.2mA; Number of Inputs: 2; Output Current: 25mA; Schmitt Trigger Input: No; Operating Supply Voltage: 5V; Low Level Output Current: 5.2mA; Width: 3.91mm; Radiation Hardening: No; REACH SVHC: No SVHC; Weight: 0.004318oz; Mount: Surface Mount; Height: 1.58mm; Packaging: Tape and Reel; Lead Free: Lead Free; Contact Plating: Gold; Min Operating Temperature: -40°C; Series: 74HC; Length: 8.65mm; Number of Bits: 4; Number of Input Lines: 2; Max Operating Temperature: 85°C; Number of Output Lines: 1; Number of Elements: 4; Number of Circuits: 4; Number of Pins: 14; RoHS Compliant: Yes; Technology: CMOS; Case/Package: SOIC; Package Quantity: 1